# Altium schematic sheet USB_0.SchDoc
size A2
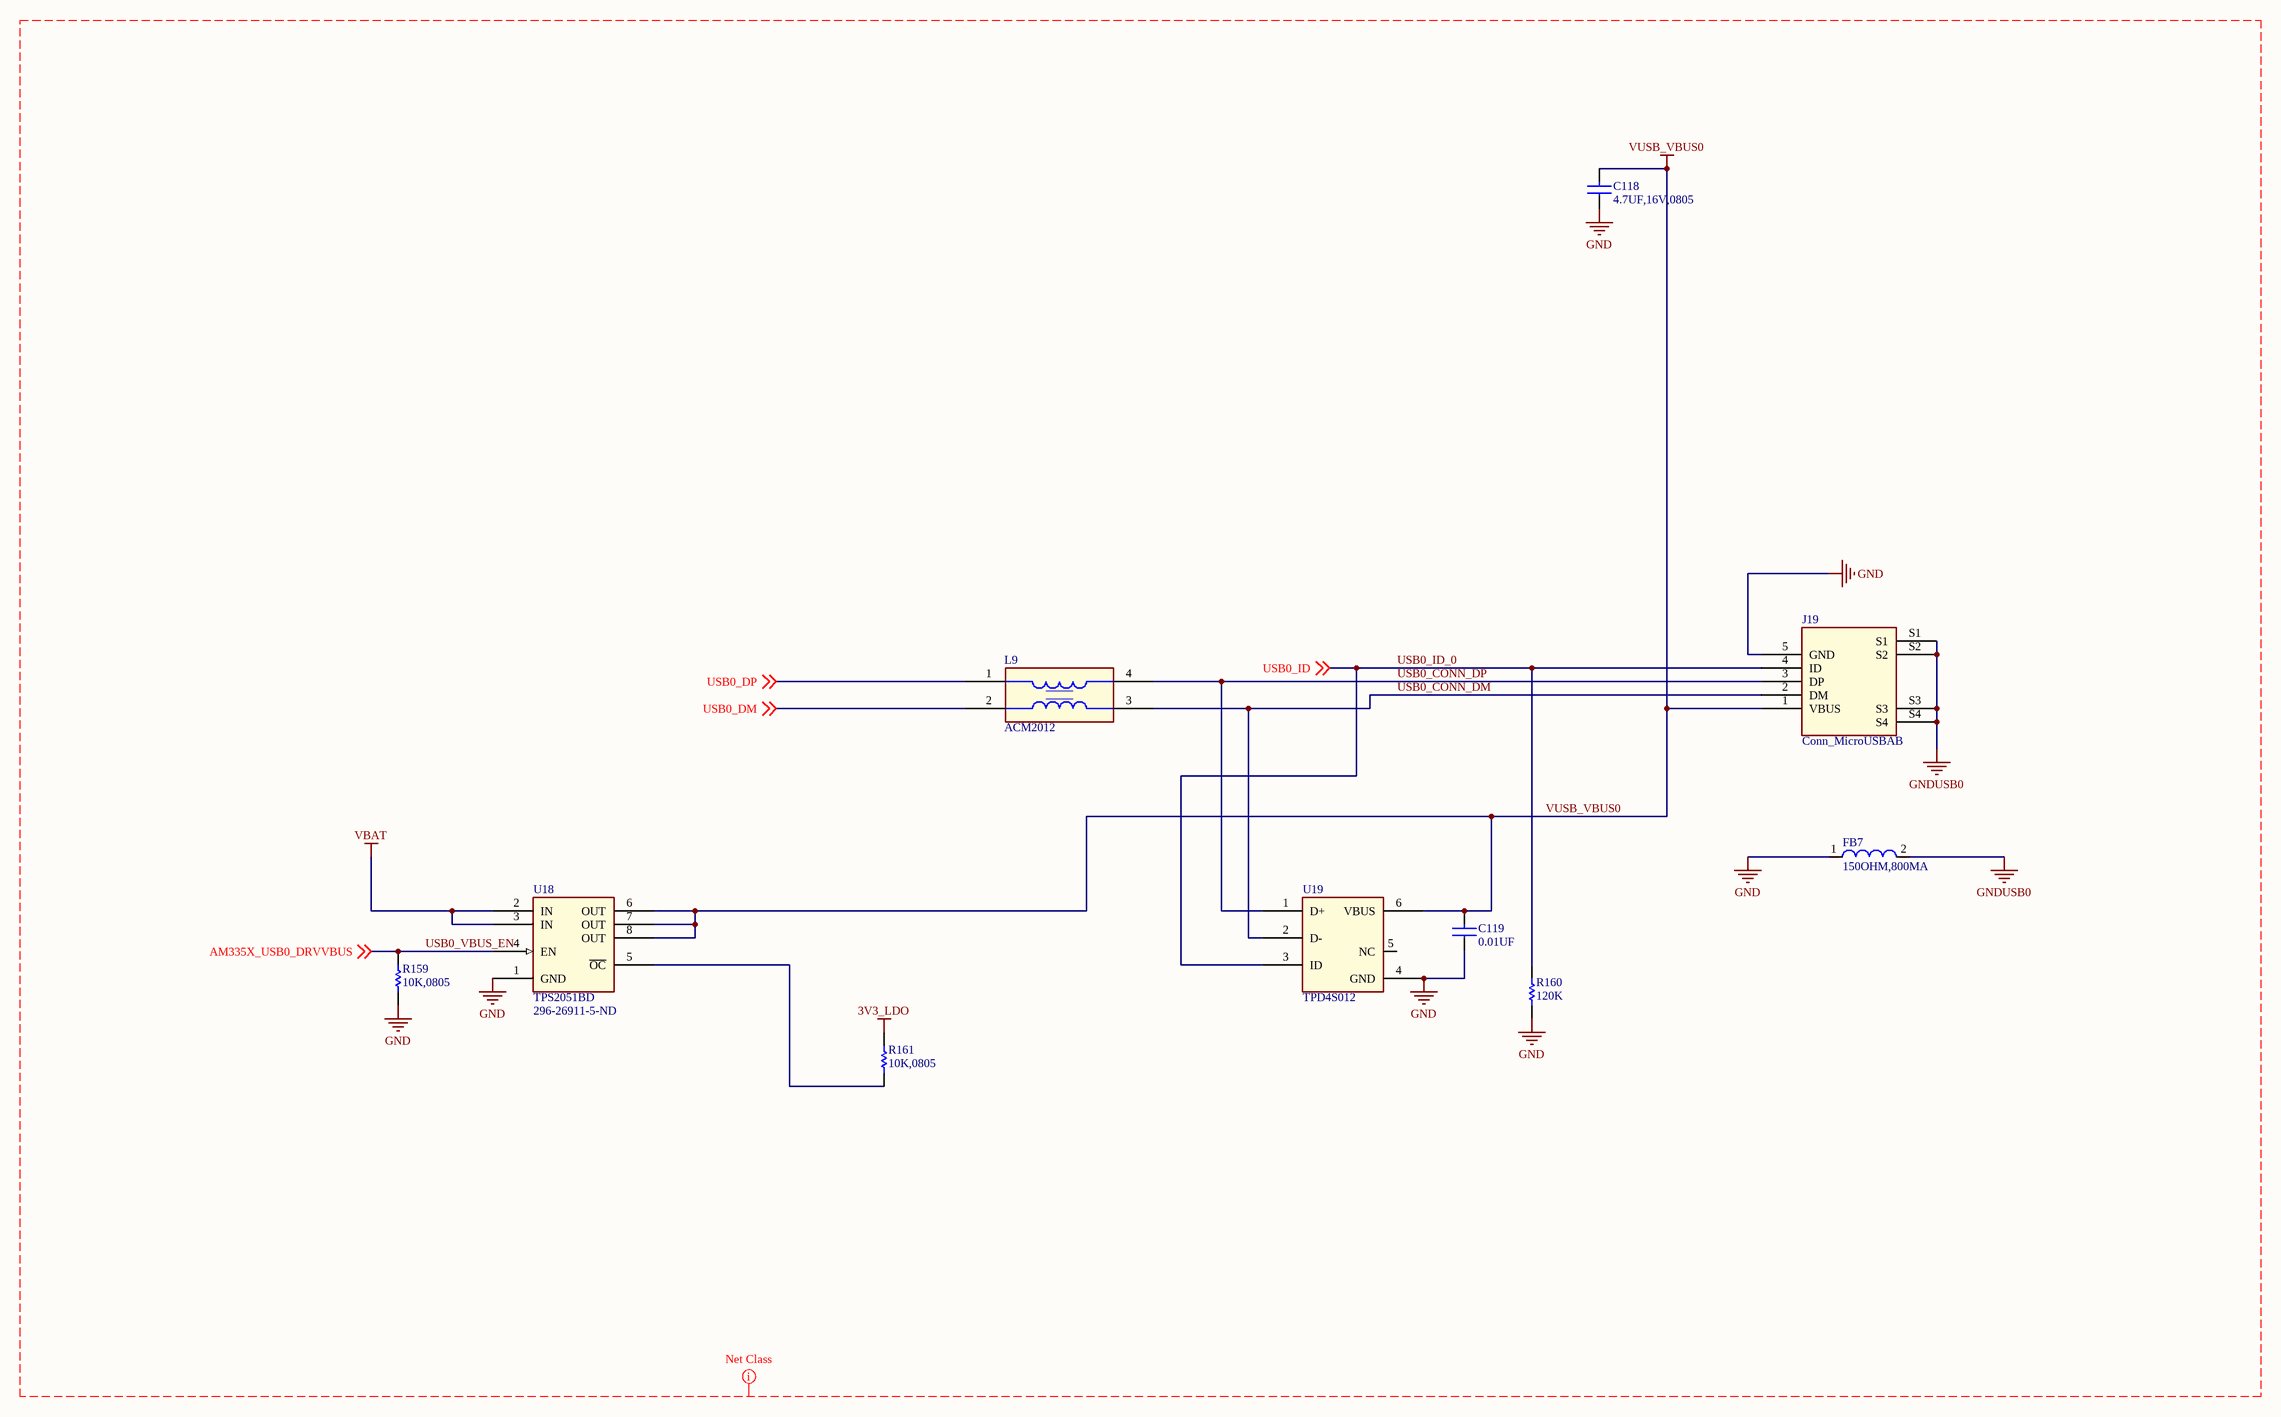
[diagram p0: USB_0.SchDoc]

## Parts
C118  4.7UF,16V,0805  [0805]
C119  0.01UF  [0805]
FB7  150OHM,800MA  [0805]
J19  Conn_MicroUSBAB  [USB MINI TYPE B]
L9  ACM2012  [ACM2012H]
R159  10K,0805  [0805]
R160  120K  [0805]
R161  10K,0805  [0805]
U18  TPS2051BD  Supplier Part Number 1: 296-26911-5-ND  [U_8_D]
U19  TPD4S012  [U_6_DRY]

## Nets
3V3_LDO: R161.2
GND: C118.1 C119.1 FB7.1 J19.5(GND) R159.1 R160.1 U18.1(GND) U19.4(GND)
GNDUSB0: FB7.2 J19.S1 J19.S2 J19.S3 J19.S4
VBAT: U18.2(IN) U18.3(IN)
VUSB_VBUS0: C118.2 C119.2 J19.1(VBUS) U18.6(OUT) U18.7(OUT) U18.8(OUT) U19.6(VBUS)
USB0_CONN_DM: J19.2(DM) L9.3 U19.2(D-)
USB0_CONN_DP: J19.3(DP) L9.4 U19.1(D+)
USB0_DM: L9.2 ; off-sheet USB0_DM
USB0_DP: L9.1 ; off-sheet USB0_DP
USB0_ID_0: J19.4(ID) R160.2 U19.3(ID) ; off-sheet USB0_ID  [also labelled USB0_ID]
USB0_VBUS_EN: R159.2 U18.4(EN) ; off-sheet AM335X_USB0_DRVVBUS  [also labelled AM335X_USB0_DRVVBUS]
NetR161_1: R161.1 U18.5(~{OC})

Not connected (* = marked no-connect by the designer): U19 5(NC)

## Layout directives
net class USB0_P: 3V3_LDO, AM335X_USB0_DRVVBUS, GND, GNDUSB0, USB0_CONN_DM, USB0_CONN_DP, USB0_DM, USB0_DP, USB0_ID, USB0_ID_0, USB0_VBUS_EN, VBAT, VUSB_VBUS0

## Library data of the parts
C118 = 4.7UF,16V,0805: AVX - 0805YC475KAT2A - CAP, MLCC, X7R, 4.7UF, 16V, 0805; Capacitance: 4.7; Capacitance Tolerance: ± 10%; Dielectric Characteristic: X7; Voltage Rating: 16; Ceramic Capacitor Case: 0805 [2012 Metric]; SVHC: No SVHC (16-Jun-2014); Capacitor Terminals: SMD; Tolerance: ±10%; Temperature Coefficient: X5R; Manufacturer: AVX; Manufacturer Part Number: 0805YC475KAT2A; RoHS: YES; Product Range: -; Operating Temperature Min: -55; Operating Temperature Max: 125; Packaging: Cut Tape; MSL: MSL 1 - Unlimited; Capacitance Tolerance ±: ± 10%; Capacitor Case Style: 0805 [2012 Metric]; Operating Temperature Range: -55°C to +125; Series: MLCC<!--FANDB--><div class="features-and-benefits-container"></div>; ComponentLink1URL: http://www.farnell.com/datasheets/1679506.pdf; ComponentLink1Description: http://www.farnell.com/datasheets/1679506.pdf; ComponentLink2URL: http://www.farnell.com/cad/1614401.zip; ComponentLink2Description: http://www.farnell.com/cad/1614401.zip; Supplier 1: Digi-Key; Category: Capacitors; Stock 1: 362746; Pricing 1: 1=0.21, 10=0.146, 25=0.1064, 100=0.0743, 500=0.0531, 1000=0.04514 (USD); Voltage - Rated: 16V; Mounting Type: Surface Mount, MLCC; Operating Temperature: -55°C ~ 85°C; Applications: General Purpose; Ratings: -; Package / Case: 0805 (2012 Metric); Size / Dimension: 0.079" L x 0.049" W (2.00mm x 1.25mm); Height - Seated (Max): -; Thickness (Max): 0.053" (1.35mm); Lead Spacing: -; Features: -; Lead Style: -; ComponentLink3URL: http://www.samsungsem.com/kr/front/downloadcms.do?path=/kr/support/product-search/mlcc/__icsFiles/afieldfile/2014/11/05&fileName=S_CL21A475KOFNNNE.pdf; ComponentLink3Description: http://www.samsungsem.com/kr/front/downloadcms.do?path=/kr/support/product-search/mlcc/__icsFiles/afieldfile/2014/11/05&fileName=S_CL21A475KOFNNNE.pdf; Supplier Part Number 1: 1276-1065-1-ND
C119 = 0.01UF: MULTICOMP - MCSH21B103K100CT - CAP, MLCC, X7R, 10NF, 10V, 0805; Capacitance: 10000pF; Tolerance: ±10%; Voltage - Rated: 16V; Manufacturer: MULTICOMP; Manufacturer Part Number: MCSH21B103K100CT; RoHS: YES; ComponentLink1URL: http://www.farnell.com/datasheets/1825494.pdf; ComponentLink1Description: http://www.farnell.com/datasheets/1825494.pdf; Category: Capacitors; Packaging: Cut Tape (CT); Temperature Coefficient: X7R; Mounting Type: Surface Mount, MLCC; Operating Temperature: -55°C ~ 125°C; Applications: General Purpose; Ratings: -; Package / Case: 0805 (2012 Metric); Size / Dimension: 0.079" L x 0.049" W (2.00mm x 1.25mm); Height - Seated (Max): -; Thickness (Max): 0.035" (0.88mm); Lead Spacing: -; Features: -; Lead Style: -; ComponentLink2URL: http://www.kemet.com/docfinder?Partnumber=C0805C103K4RACTU; ComponentLink2Description: http://www.kemet.com/docfinder?Partnumber=C0805C103K4RACTU; Supplier 1: Digi-Key; Stock 1: 3115623; Pricing 1: 1=0.1, 10=0.012, 50=0.0066, 100=0.0057, 250=0.00464, 500=0.00396, 1000=0.00309, 5000=0.00258 (USD); ComponentLink3URL: http://www.murata.com/~/media/webrenewal/support/library/catalog/products/capacitor/mlcc/c02e.ashx; ComponentLink3Description: http://www.murata.com/~/media/webrenewal/support/library/catalog/products/capacitor/mlcc/c02e.ashx; Supplier Part Number 1: 490-1313-1-ND
FB7 = 150OHM,800MA: FERRITE 800MA 150 OHM 0805 SMD; Manufacturer: Laird-Signal Integrity Products; Manufacturer Part Number: LI0805H151R-10; Impedance @ Frequency: 150 Ohm @ 100MHz; DC Resistance (DCR): 150 mOhm Max; Filter Type: Differential Mode - Single; Supplier 1: Digi-Key; RoHS: RoHS Compliant; Category: Filters; Stock 1: 418596; Pricing 1: 1=0.1, 10=0.07, 25=0.064, 50=0.0574, 100=0.0421, 250=0.03064, 500=0.02808, 1000=0.02424 (USD); Packaging: Cut Tape (CT); Current Rating: 800mA; Package / Case: 0805 (2012 Metric); Mounting Type: Surface Mount; Height (Max): 0.043" (1.10mm); Size / Dimension: 0.079" L x 0.049" W (2.00mm x 1.25mm); ComponentLink1URL: http://www.lairdtech.com/WorkArea/linkit.aspx?LinkIdentifier=id&ItemID=4912; ComponentLink1Description: http://www.lairdtech.com/WorkArea/linkit.aspx?LinkIdentifier=id&ItemID=4912; Supplier Part Number 1: 240-2384-1-ND
J19 = Conn_MicroUSBAB: Connector Micro USB AB RA; TIIntPartnumber: 2C0088; MfrNum: ZX62-AB-5PA(11); Mfr: Hirose; Cost10K: 0.26; Cost100: 0.67; Vendor: Digikey; DescriptiveText: Connector Micro USB AB RA; PartName: ConnectorMicroUSBAB; Descriptive_Text: Connector Micro USB AB RA; Supplier 1: Digi-Key; Supplier Part Number 1: H11635CT-ND
L9 = ACM2012: Common Mode Filter for USB/HDMI; Mfr: TDK; MfrNum: ACM2012H-900-2P; TIIntPartnumber: 1M0003; Vendor: Arrow; Cost100: 1.11; Cost10K: 0.42; DescriptiveText: Common Mode Filter for USB/HDMI; PartName: ACM2012; Descriptive_Text: Common Mode Filter for USB/HDMI; Supplier 1: Digi-Key; Supplier Part Number 1: 445-5193-6-ND
R159 R161 = 10K,0805: BOURNS - CR0805-FX-1002GLF - RESISTOR, 10K, 0.125W, 1%; Product Range: BOURNS - CR Series; Resistance: 10; Power Rating: 125; Resistor Case Style: 0805 [2012 Metric]; Resistor Element Material: Thick Film; Temperature Coefficient: ± 100; Voltage Rating: 150; SVHC: No SVHC (16-Jun-2014); Resistor Mounting: SMD<!--FANDB--><div class="features-and-benefits-container"></div>; Power (Watts): 0.125W, 1/8W; Manufacturer: BOURNS; Manufacturer Part Number: CR0805-FX-1002GLF; RoHS: YES; Resistance Tolerance: ± 1%; Packaging: Cut Tape; MSL: MSL 1 - Unlimited; ComponentLink1URL: http://www.farnell.com/datasheets/1845293.pdf; ComponentLink1Description: http://www.farnell.com/datasheets/1845293.pdf; Supplier 1: Digi-Key; Category: Resistors; Stock 1: 1116166; Pricing 1: 1=0.1, 10=0.029, 50=0.0162, 100=0.0123, 250=0.00912, 500=0.00672, 1000=0.00448, 2500=0.00378 (USD); Resistance (Ohms): 10k; Tolerance: ±1%; Composition: Thick Film; Features: -; Operating Temperature: -55°C ~ 155°C; Package / Case: 0805 (2012 Metric); Supplier Device Package: 0805; Size / Dimension: 0.079" L x 0.049" W (2.00mm x 1.25mm); Height: 0.026" (0.65mm); Number of Terminations: 2; ComponentLink2URL: http://www.seielect.com/Catalog/SEI-RMCF_RMCP.pdf; ComponentLink2Description: http://www.seielect.com/Catalog/SEI-RMCF_RMCP.pdf; Supplier Part Number 1: RMCF0805FT10K0CT-ND
R160 = 120K: TE CONNECTIVITY - CRGH0805F120K - RESISTOR, POWER, 120K, 0.33W, 1%, 0805; Product Range: TE CONNECTIVITY - CRG Series; Resistance: 120; Power Rating: 330; Resistor Case Style: 0805 [2012 Metric]; Resistor Element Material: Thick Film; Temperature Coefficient: ± 100; Voltage Rating: 150; Power (Watts): 0.125W, 1/8W; Manufacturer: TE CONNECTIVITY; Manufacturer Part Number: CRGH0805F120K; RoHS: YES; Resistance Tolerance: ± 1%; Packaging: Cut Tape; MSL: -<!--FANDB--><div class="features-and-benefits-container"></div>; ComponentLink1URL: http://www.farnell.com/datasheets/1755795.pdf; ComponentLink1Description: http://www.farnell.com/datasheets/1755795.pdf; Supplier 1: Digi-Key; Category: Resistors; Stock 1: 39423; Pricing 1: 1=0.1, 50=0.0288, 100=0.0219, 250=0.01624, 500=0.012, 1000=0.008, 2500=0.00675 (USD); Resistance (Ohms): 120k; Tolerance: ±1%; Composition: Thick Film; Features: Automotive AEC-Q200; Operating Temperature: -55°C ~ 155°C; Package / Case: 0805 (2012 Metric); Supplier Device Package: 0805; Size / Dimension: 0.079" L x 0.049" W (2.00mm x 1.25mm); Height: 0.028" (0.70mm); Number of Terminations: 2; ComponentLink2URL: http://industrial.panasonic.com/www-cgi/jvcr13pz.cgi?E+PZ+3+AOA0002+ERJ6ENF1203V+7+WW; ComponentLink2Description: http://industrial.panasonic.com/www-cgi/jvcr13pz.cgi?E+PZ+3+AOA0002+ERJ6ENF1203V+7+WW; Supplier Part Number 1: P120KCCT-ND
U18 = TPS2051BD: Power Distribution Switch Current Limited 500mA; Mfr: TI; TIIntPartnumber: 1A0286; Vendor: Digikey; Cost100: 1.70; Cost10K: 0.39; DescriptiveText: Power Distribution Switch Current Limited 500mA; PartName: TPS2051BD; MfrNum: TPS2051BD; Descriptive_Text: Power Distribution Switch Current Limited 500mA; Supplier 1: Digi-Key
U19 = TPD4S012: ESD 4channel USB Interface; Mfr: TI; MfrNum: TPD4S012DRY; TIIntPartnumber: 1A0233; Vendor: Digikey; Cost100: 0.76; Cost10K: 0.23; DescriptiveText: ESD 4channel USB Interface; PartName: TPD4S012; Descriptive_Text: ESD 4channel USB Interface; Supplier 1: Digi-Key; Supplier Part Number 1: 296-24244-1-ND